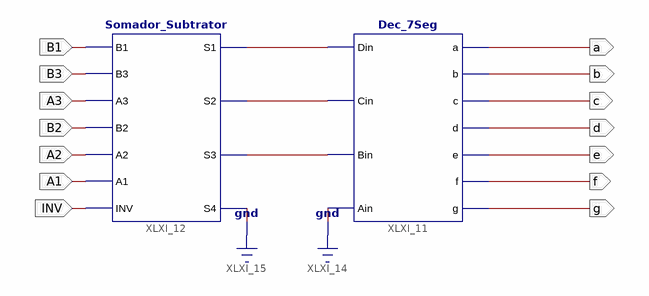
[diagram p0: schematic sheet 1]
// Xilinx ISE schematic Sistema.sch (spartan3) as structural Verilog: 2 symbols, 14 ports
module Sistema (
  input  A1,
  input  A2,
  input  B2,
  input  A3,
  input  B3,
  input  B1,
  input  INV,
  output b,
  output c,
  output e,
  output f,
  output g,
  output a,
  output d
);

  wire XLXN_65, XLXN_66, XLXN_67;

  Dec_7Seg XLXI_11 (
    .Din(XLXN_65), .Cin(XLXN_66), .Bin(XLXN_67), .Ain(1'b0), .a(a), .b(b), .c(c), .d(d), .e(e), .f(f), .g(g));
  Somador_Subtrator XLXI_12 (
    .B1(B1), .B3(B3), .A3(A3), .B2(B2), .A2(A2), .A1(A1), .INV(INV), .S1(XLXN_65), .S2(XLXN_66),
    .S3(XLXN_67), .S4(1'b0));
endmodule
